# EAGLE design Board (EAGLE 9.2.2)
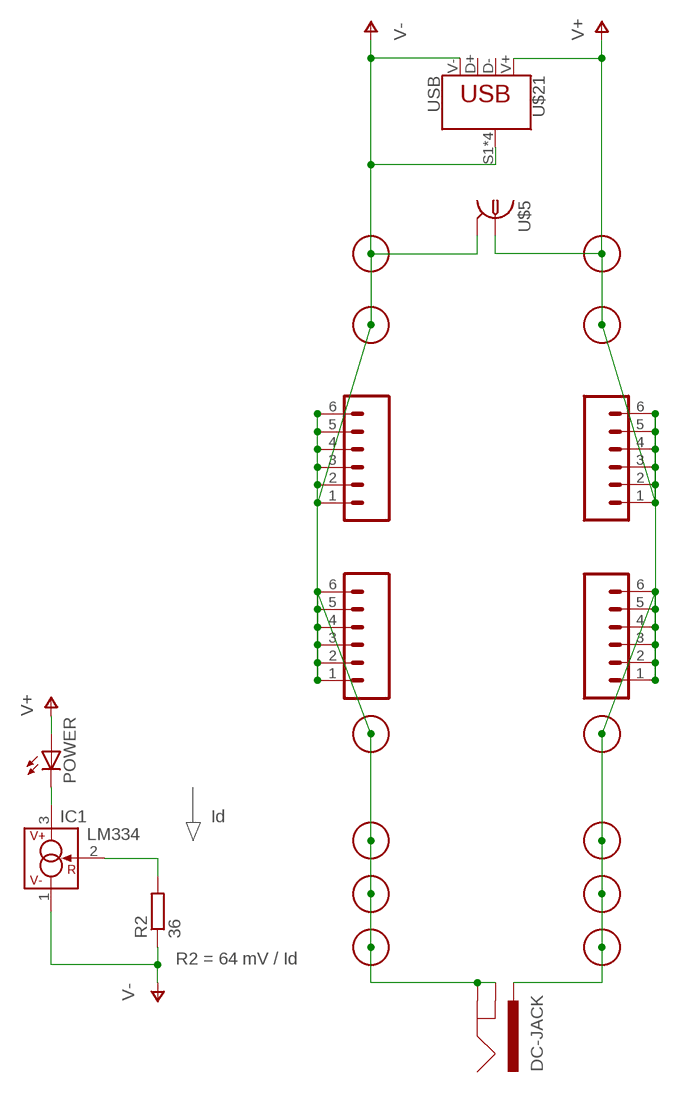
[diagram p0: schematic, sheet 1]

## Parts
IC1  LM334  LM334SM  [SO08]
POWER  LED5MM  [LED5MM]
R2  36  R-EU_R0603  [R0603]
U$1  6MM-BANANA-PLUGSCREW-BLACK  [6MM-TERMINAL-POST-BLACK]
U$2  6MM-BANANA-PLUGSCREW-RED  [6MM-TERMINAL-POST-RED]
U$3  6MM-BANANA-PLUGSCREW-BLACK  [6MM-TERMINAL-POST-BLACK]
U$4  6MM-BANANA-PLUGSCREW-RED  [6MM-TERMINAL-POST-RED]
U$5  BNC-VTE-1-1337541-0  [BNC-V]
U$6  PINHEADER-1X6MALE_LOCK  [1X06_LOCK]
U$7  PINHEADER-1X6MALE_LOCK  [1X06_LOCK]
U$8  PINHEADER-1X6FEMALE_LOCK  [1X06_FEMALE_LOCK.010]
U$9  PINHEADER-1X6FEMALE_LOCK  [1X06_FEMALE_LOCK.010]
U$10  TERMINAL-BLOCK-2  [MKDSN1,5/2-5,08]
U$12  DC-JACK  [POWER_JACK_PTH]
U$14  TERMINAL-1  [TE-726386]
U$15  TERMINAL-1  [TE-726386]
U$16  TERMINAL-1BRIDGE  [VOGT-1098A.68]
U$17  TERMINAL-1BRIDGE  [VOGT-1098A.68]
U$18  TERMINAL-1  [TE-726386]
U$19  TERMINAL-1  [TE-726386]
U$21  USB  [ECON-USBBUVA]

## Nets
N$1: IC1.2(R) R2.2
N$2: IC1.3(V+) POWER.K(C)
V+: POWER.A U$2.P$1 U$4.P$1 U$5.CONDUCTOR1(C) U$7.1 U$7.2 U$7.3 U$7.4 U$7.5 U$7.6 U$9.1 U$9.2 U$9.3 U$9.4 U$9.5 U$9.6 U$10.1 U$12.PWR U$15.P$1 U$15.P$2 U$16.P$1 U$16.P$2 U$19.P$1 U$19.P$2 U$21.V+(VBUS)
V-: IC1.1(V-) R2.1 U$1.P$1 U$3.P$1 U$5.CONDUCTOR2(S) U$5.SHIELD1(S) U$5.SHIELD2(S) U$6.1 U$6.2 U$6.3 U$6.4 U$6.5 U$6.6 U$8.1 U$8.2 U$8.3 U$8.4 U$8.5 U$8.6 U$10.2 U$12.GND U$12.GNDBREAK U$14.P$1 U$14.P$2 U$17.P$1 U$17.P$2 U$18.P$1 U$18.P$2 U$21.S1(SHIELD) U$21.S2(SHIELD) U$21.S3(SHIELD) U$21.S4(SHIELD) U$21.V-(GND)
Unconnected: U$21.D+ U$21.D-

## Notes on the sheet
- Id
- R2 = 64 mV / Id

## Library data of the parts
IC1 = linear:LM*34: 3-Terminal Adjustable Current Sources Source: www.national.com/pf/LM/LM334.html | LM134.pdf
POWER = led:LED: LED OSRAM: - CHIPLED LG R971, LG N971, LY N971, LG Q971, LY Q971, LO R971, LY R971 LH N974, LH R974 LS Q976, LO Q976, LY Q976 LO Q996 - Hyper CHIPLED LW Q18S LB Q993, LB Q99A, LB R99A - SideLED LS A670, LO A670, LY A670, LG A670, LP A670 LB A673, LV A673, LT A673, LW A673 LH A674 LY A675 LS A676, LA A676, LO A676, LY A676, LW A676 LS A679, LY A679, LG A679 - Hyper Micro SIDELED® LS Y876, LA Y876, LO Y876, LY Y876 LT Y87S - SmartLED LW L88C, LW L88S LB L89C, LB L89S, LG L890 LS L89K, LO L89K, LY L89K LS L896, LA L896, LO L896, LY L896 - TOPLED LS T670, LO T670, LY T670, LG T670, LP T670 LSG T670, LSP T670, LSY T670, LOP T670, LYG T670 LG T671, LOG T671, LSG T671 LB T673, LV T673, LT T673, LW T673 LH T674 LS T676, LA T676, LO T676, LY T676, LB T676, LH T676, LSB T676, LW T676 LB T67C, LV T67C, LT T67C, LS T67K, LO T67K, LY T67K, LW E67C LS E67B, LA E67B, LO E67B, LY E67B, LB E67C, LV E67C, LT E67C LW T67C LS T679, LY T679, LG T679 LS T770, LO T770, LY T770, LG T770, LP T770 LB T773, LV T773, LT T773, LW T773 LH T774 LS E675, LA E675, LY E675, LS T675 LS T776, LA T776, LO T776, LY T776, LB T776 LHGB T686 LT T68C, LB T68C - Hyper Mini TOPLED® LB M676 - Mini TOPLED Santana® LG M470 LS M47K, LO M47K, LY M47K Source: http://www.osram.convergy.de LUXEON: - LUMILED® LXK2-PW12-R00, LXK2-PW12-S00, LXK2-PW14-U00, LXK2-PW14-V00 LXK2-PM12-R00, LXK2-PM12-S00, LXK2-PM14-U00 LXK2-PE12-Q00, LXK2-PE12-R00, LXK2-PE12-S00, LXK2-PE14-T00, LXK2-PE14-U00 LXK2-PB12-K00, LXK2-PB12-L00, LXK2-PB12-M00, LXK2-PB14-N00, LXK2-PB14-P00, LXK2-PB14-Q00 LXK2-PR12-L00, LXK2-PR12-M00, LXK2-PR14-Q00, LXK2-PR14-R00 LXK2-PD12-Q00, LXK2-PD12-R00, LXK2-PD12-S00 LXK2-PH12-R00, LXK2-PH12-S00 LXK2-PL12-P00, LXK2-PL12-Q00, LXK2-PL12-R00 Source: www.luxeon.com KINGBRIGHT: KA-3528ASYC Source: www.kingbright.com
R2 = rcl:R-EU_: RESISTOR, European symbol; SPICEPREFIX: R
U$1-U$4 = AdapterBoard:6MM-BANANA-PLUG
U$5 = AdapterBoard:BNC-V; MANUFACTURERNUMBER: TE-Connectivity 1-1337541-0
U$6-U$9 = AdapterBoard:PINHEADER-1X6
U$10 = AdapterBoard:TERMINAL-BLOCK-2
U$12 = Parts:DC-JACK
U$14-U$19 = AdapterBoard:TERMINAL-1
U$21 = AdapterBoard:USB

## Board
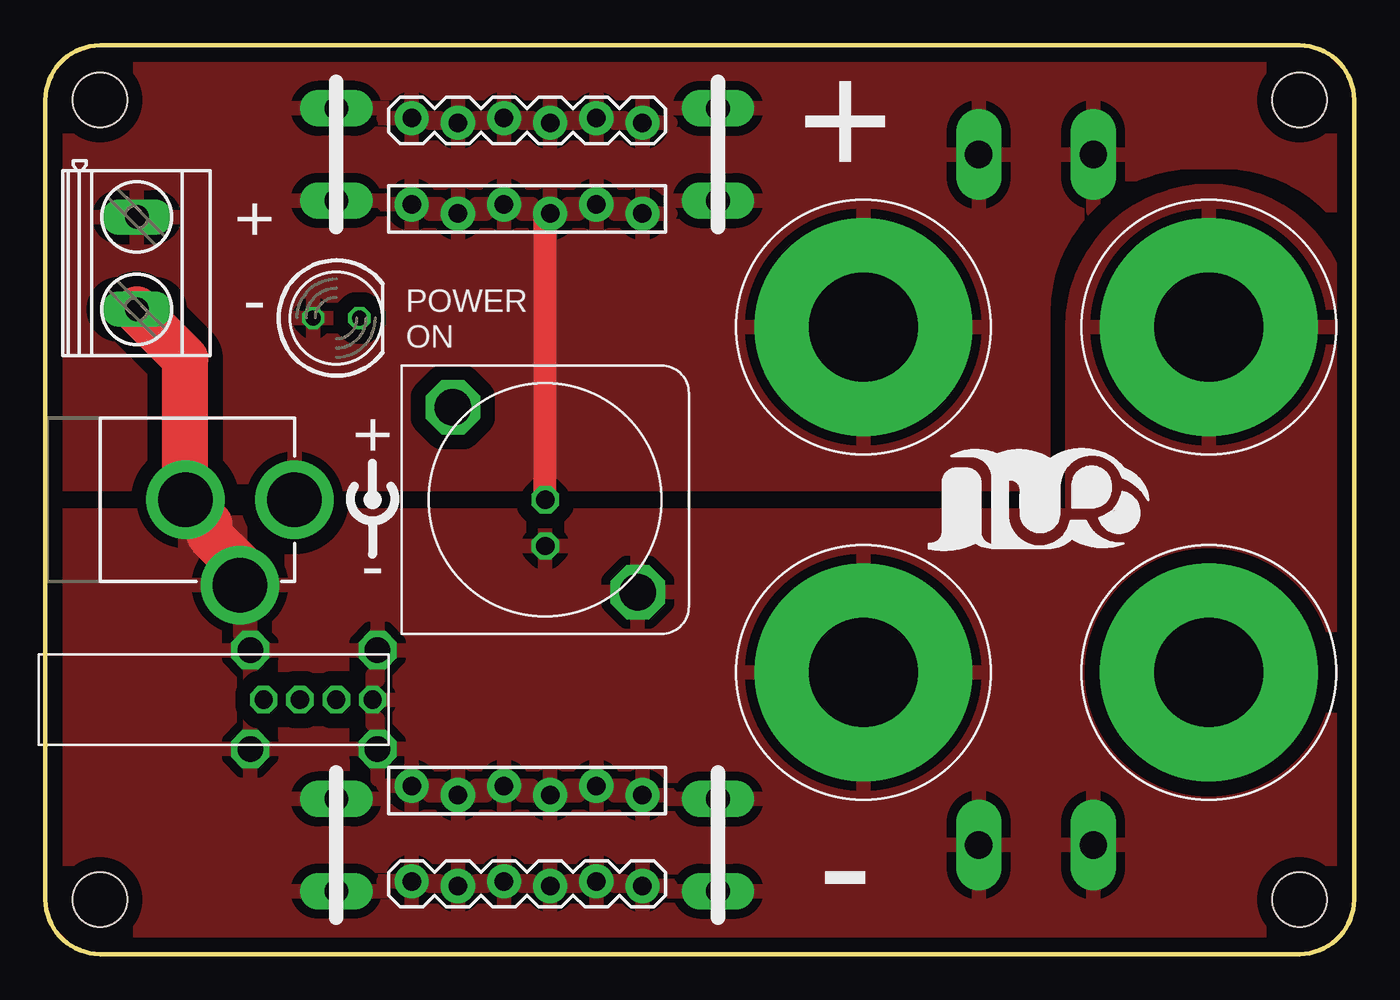
[diagram p1: board, top side]
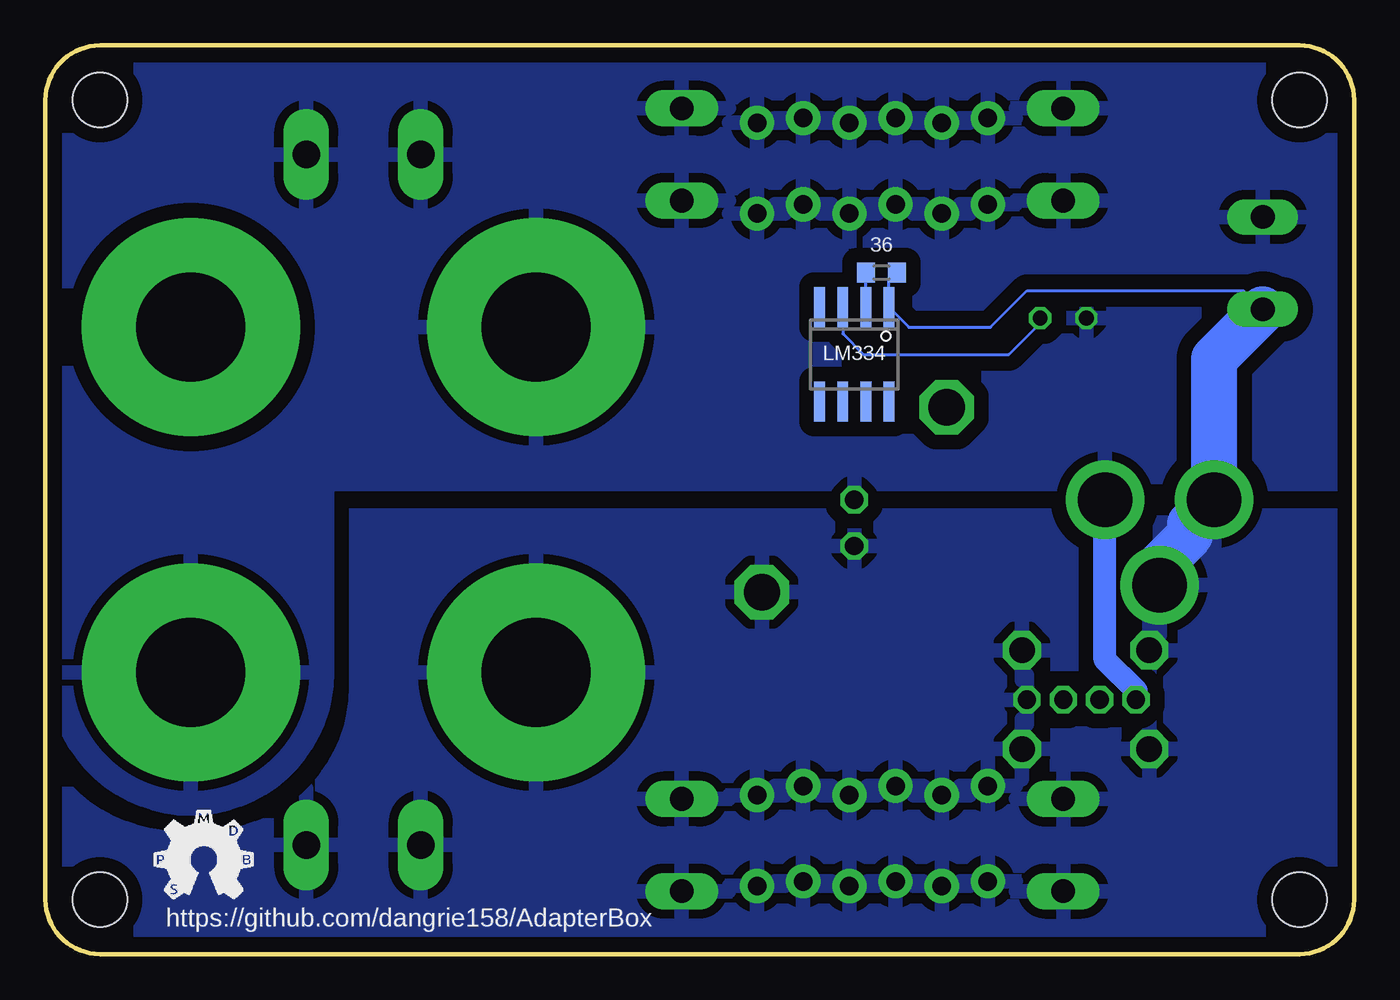
[diagram p2: board, bottom side, seen from below]

Size 72 x 50 mm. Coordinates in mm from the lower left corner, seen from the top.
Outline: 3,0 69,0 arc90 72,3 72,47 arc90 69,50 3,50 arc90 0,47 0,3 arc90 3,0
Copper layers (1*16): Top 0.035559375mm / dielectric 1.6mm / Bottom 0.035559375mm
Design rules "oshpark-2layer *": minimum track width 6mil, minimum drill 10mil, track to track 8mil, track to pad 8mil, pad to pad 8mil, via to via 8mil, smd to smd 0mil, copper to edge 25mil, drill to drill 6mil, minimum pad ring 5mil, minimum via ring 5mil, stop-mask expansion 2.5mil, vias tented up to drill 0mil, thermal gap 20mil
Holes 3 mm at 3,3 69,3 69,47 3,47

### Footprints (pad centres in the part's own frame; a part is rotated, then mirrored left to right if it is on the bottom)
SO08 = smd 0.6 x 2.2: 1 -1.905,-2.6; 2 -0.635,-2.6; 3 0.635,-2.6; 4 1.905,-2.6; 5 1.905,2.6; 6 0.635,2.6; 7 -0.635,2.6; 8 -1.905,2.6
LED5MM = drill 0.813 octagon: A -1.27,0; K 1.27,0
R0603 = smd 1 x 1.1: 1 -0.85,0; 2 0.85,0
6MM-TERMINAL-POST-BLACK = drill 6 pad 12: P$1 0,0
6MM-TERMINAL-POST-RED = drill 6 pad 12: P$1 0,0
BNC-V = drill 1 octagon: CONDUCTOR1 0,0; CONDUCTOR2 -2.54,0 | drill 2 octagon: SHIELD1 -5.08,-5.08; SHIELD2 5.08,5.08
1X06_LOCK = drill 1.016 pad 1.88: 1 0,0; 2 2.54,-0.254; 3 5.08,0; 4 7.62,-0.254; 5 10.16,0; 6 12.7,-0.254
1X06_FEMALE_LOCK.010 = drill 1.016 pad 1.88: 1 0,0.254; 2 2.54,-0.254; 3 5.08,0.254; 4 7.62,-0.254; 5 10.16,0.254; 6 12.7,-0.254
MKDSN1,5/2-5,08 = drill 1.3 long: 1 -2.561,0.025; 2 2.519,0.025
POWER_JACK_PTH = drill 2.997 pad 4.318: GND 0,7.7; GNDBREAK 4.7,10.7; PWR 0,13.7
TE-726386 = drill 1.3 pad 2 long: P$1 -2.54,0; P$2 2.54,0
VOGT-1098A.68 = drill 1.5 pad 2.5 long: P$1 -3.15,0; P$2 3.15,0
ECON-USBBUVA = drill 1 octagon: D+ 4,0; D- 2,0; V+ 0,0; V- 6,0 | drill 1.4 octagon: S1 -0.73,2.72; S2 6.27,2.72; S3 -0.73,-2.72; S4 6.27,-2.72

### Placement (x,y rotation side)
IC1  27.5,33 180 bottom
POWER  16,35 0 top
R2  26,37.5 180 bottom
U$1  64,34.5 180 top
U$2  45,34.5 180 top
U$3  45,15.5 180 top
U$4  64,15.5 180 top
U$5  27.5,25 90 top
U$6  20.15,4 0 top
U$7  20.15,46 0 top
U$8  20.15,9 0 top
U$9  20.15,41 0 top
U$10  5,38 270 top
U$12  0,25 270 top
U$13  [LOGO-SILKSCREEN]  54.5,24 0 top
U$14  37,6 270 top
U$15  37,44 270 top
U$16  54.5,44 0 top
U$17  54.5,6 0 top
U$18  16,6 90 top
U$19  16,44 90 top
U$21  12,14 0 top

### Tracks (layer width: path | path; a pad name or v marks a point on that pad's centre or on a via)
N$1
  Bottom 0.152: IC1.2 26.86,37.48 R2.2
N$2
  Bottom 0.152: IC1.3 28.14,34.13 27,33 19,33 17.27,34.73 POWER.K
V+
  Top 1.27: U$5.CONDUCTOR1 27.5,40.48 U$9.4
  Bottom 1.27: U$12.PWR 13.7,16.2 12,14.5 U$21.V+
  pour Top (isolate 0.813, rank 2): 0,25.88 72,25.88 72,50 0,50
  pour Bottom (isolate 0.813, rank 2): 0,25.88 72,25.88 72,50 0,50
  pour Bottom (isolate 0.813): 56.5,15.5 arc90 64,8 arc90 71.5,15.5 71.5,50 56.5,50
V-
  Top 2.54: U$12.GNDBREAK 10.7,21.38 9.02,23.06 9.02,23.68 U$12.GND 7.7,32.76 5.03,35.44 U$10.2
  Bottom 0.152: R2.1 25.59,37.05 IC1.1 24.5,34.5 20,34.5 18,36.5 6.09,36.5 5.03,35.44
  Bottom 2.54: U$12.GNDBREAK 10.7,21.38 9.02,23.06 9.02,23.68 U$12.GND 7.7,32.76 5.03,35.44 U$10.2
  pour Top (isolate 0.813, rank 3): 0,24.12 0,0 72,0 72,24.12
  pour Bottom (isolate 0.813, rank 3): 0,24.12 0,0 72,0 72,24.12
  pour Top (isolate 0.813): 56.5,34.5 arc-90 64,42 arc-90 71.5,34.5 71.5,0 56.5,0

### Text on the board
tPlace: + | + | - | + | - | -
bPlace: https://github.com/dangrie158/AdapterBox
tNames: ON
tDocu: Gehäuse: / https://www.conrad.de/de/tru-components-tc-2024-sw203-universal-gehaeuse-72-x-50-x-26-abs-schwarz-1-st-1588559.html